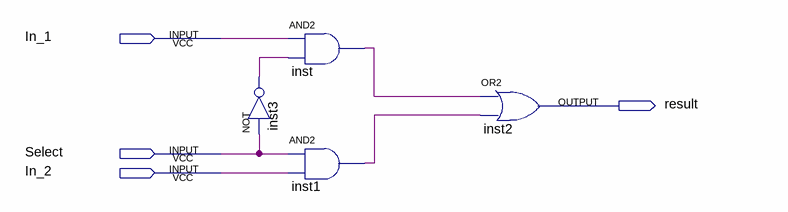
[diagram p0: schematic sheet]
// Quartus schematic 2to1Mux.bdf as structural Verilog: 4 symbols, 4 pins
module \2to1Mux  (
  input  In_1,
  input  Select,
  input  In_2,
  output result
);

  wire inst1_out, inst3_out, inst_out;

  not inst3 (inst3_out, Select);
  and inst (inst_out, In_1, inst3_out);
  and inst1 (inst1_out, Select, In_2);
  or inst2 (result, inst_out, inst1_out);
endmodule
